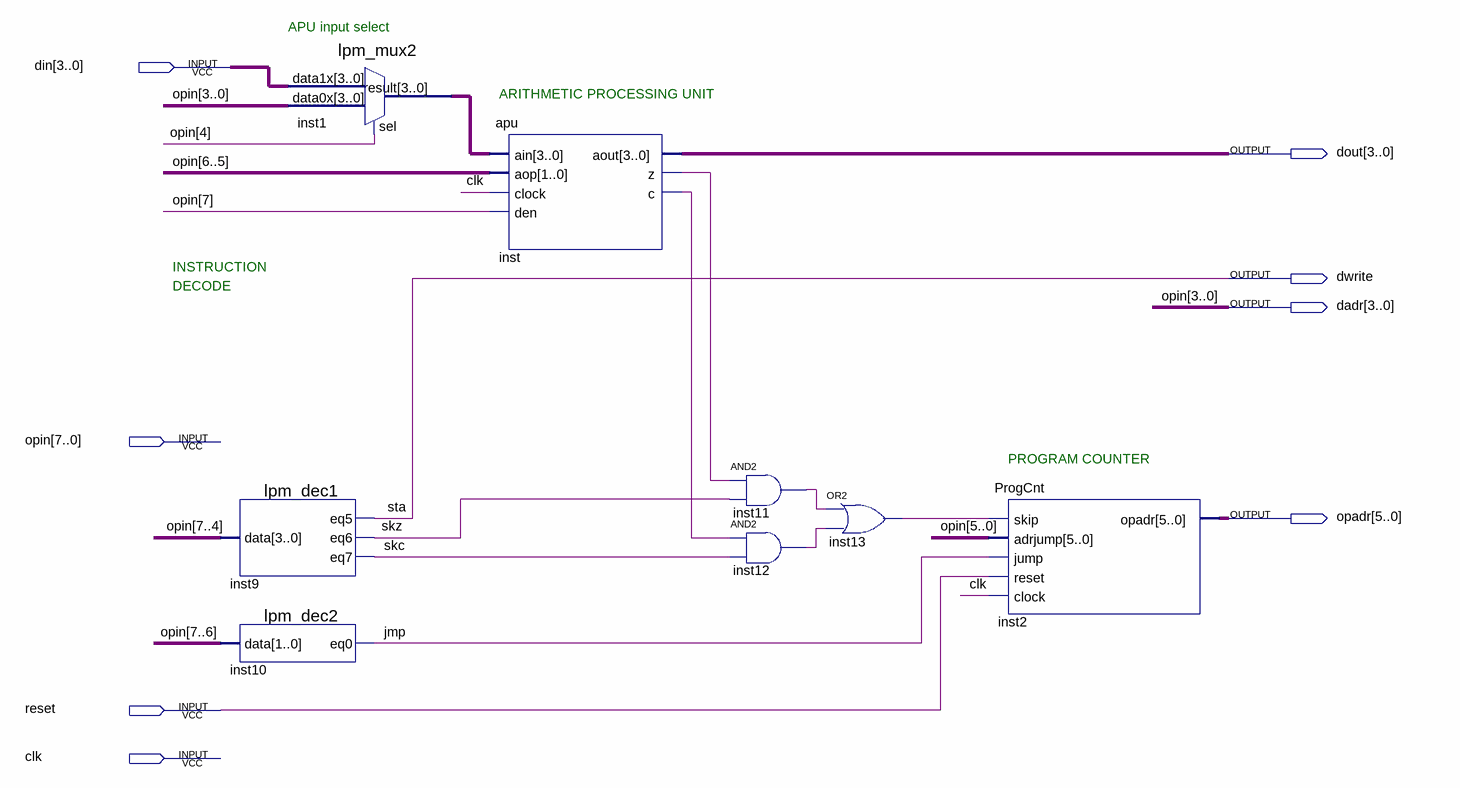
[diagram p0: schematic sheet]
// Quartus schematic UC127B.bdf as structural Verilog: 8 symbols, 8 pins
module UC127B (
  input  [3:0] din,
  input  [7:0] opin,
  input  reset,
  input  clk,
  output [3:0] dout,
  output dwrite,
  output [3:0] dadr,
  output [5:0] opadr
);

  wire inst11_out, inst12_out, inst13_out, inst_c, inst_z, jmp, skc, skz;
  wire [3:0] inst1_result;

  lpm_mux2 inst1 (.data1x(din), .data0x(opin[3:0]), .sel(opin[4]), .result(inst1_result));
  lpm_dec1 inst9 (.data(opin[7:4]), .eq5(dwrite), .eq6(skz), .eq7(skc));
  lpm_dec2 inst10 (.data(opin[7:6]), .eq0(jmp));
  apu inst (.ain(inst1_result), .aop(opin[6:5]), .clock(clk), .den(opin[7]), .aout(dout), .z(inst_z), .c(inst_c));
  and inst11 (inst11_out, inst_z, skz);
  and inst12 (inst12_out, inst_c, skc);
  or inst13 (inst13_out, inst11_out, inst12_out);
  ProgCnt inst2 (.skip(inst13_out), .adrjump(opin[5:0]), .jump(jmp), .reset(reset), .clock(clk), .opadr(opadr));

  assign dadr = opin[3:0];

  // Other names for the same wires on the sheet: sta = dwrite

  // Notes on the sheet:
  //   APU input select
  //   ARITHMETIC PROCESSING UNIT
  //   INSTRUCTION
  //   DECODE
  //   PROGRAM COUNTER
endmodule
